# Altium schematic sheet mainDiagram.SchDoc
size A; DocumentNumber: 1; SheetNumber: 1; SheetTotal: 5
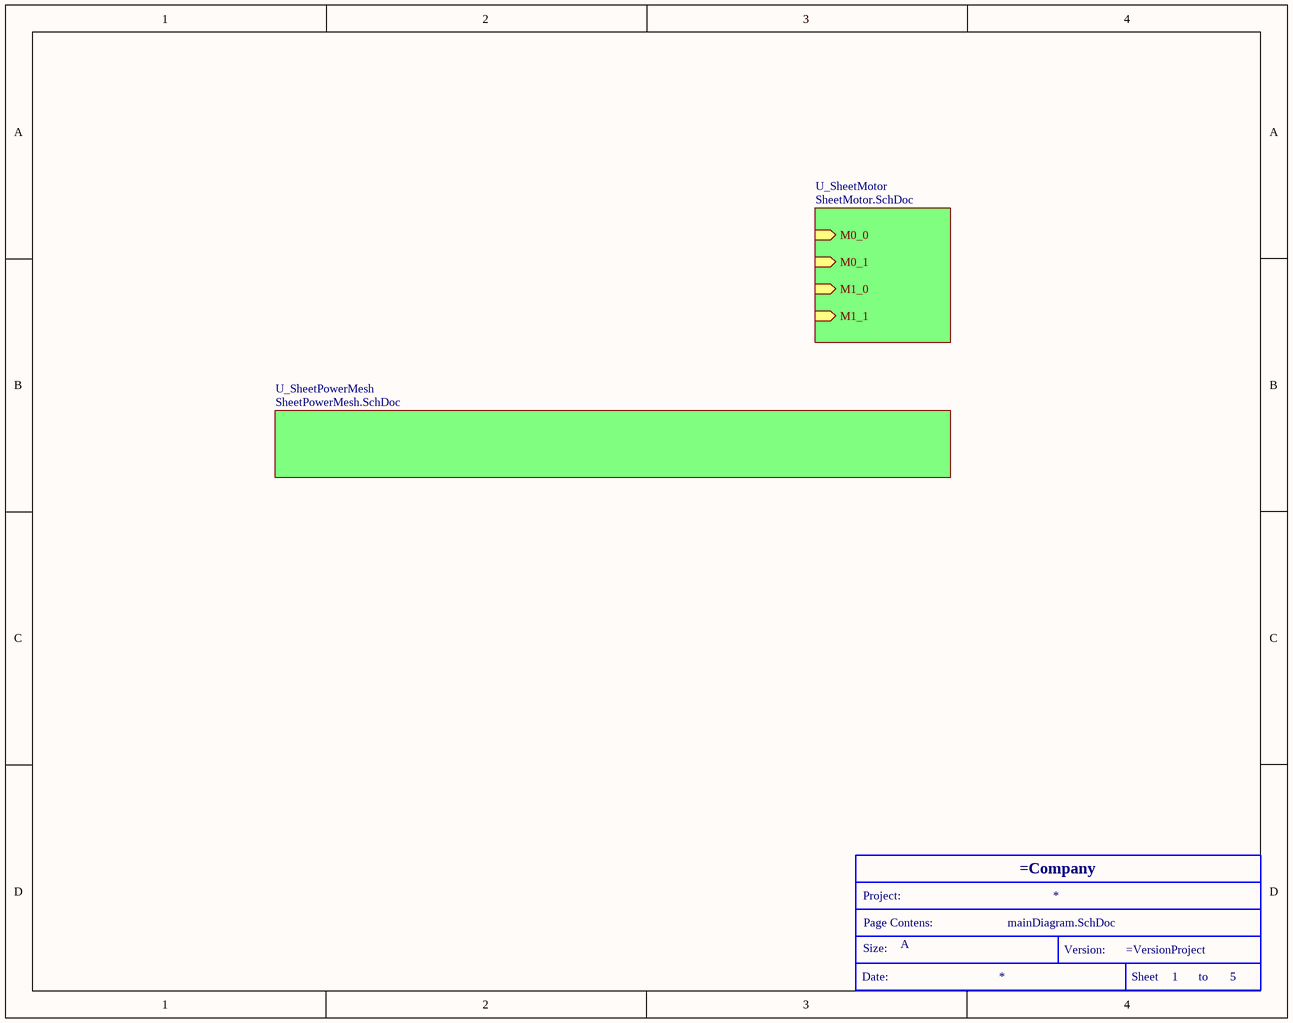
[diagram p0: mainDiagram.SchDoc]

## Parts
*  SizePage: A  (hidden comment: TitleBlock)  (graphical)

## Sub-sheets
U_SheetMotor = SheetMotor.SchDoc: M0_0 (in), M0_1 (in), M1_0 (in), M1_1 (in)
U_SheetPowerMesh = SheetPowerMesh.SchDoc: no entries

## Notes on the sheet
- (in symbol TitleBlock) Project:; Page Contens:; Size:; Version:; Date:; Sheet; to